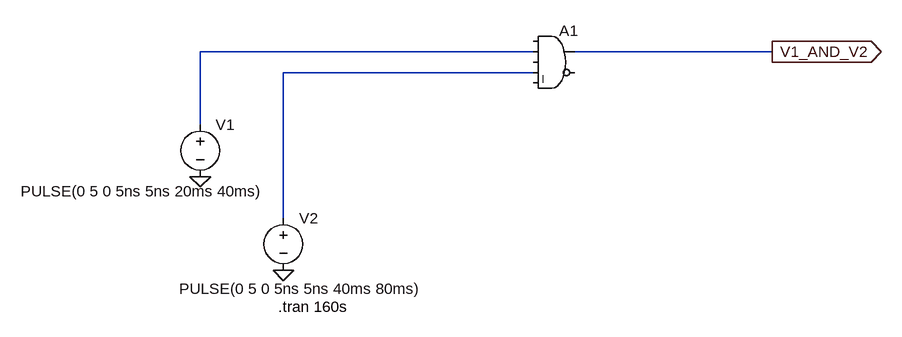
[diagram p0: schematic And gate.asc]
And gate.asc, the LTspice schematic file:
Version 4
SHEET 1 1144 680
WIRE 576 -48 64 -48
WIRE 944 -48 640 -48
WIRE 576 -16 192 -16
WIRE 64 64 64 -48
WIRE 192 208 192 -16
FLAG 64 144 0
FLAG 192 288 0
FLAG 944 -48 V1_AND_V2
IOPIN 944 -48 Out
SYMBOL voltage 64 48 R0
WINDOW 3 -276 119 Left 2
WINDOW 123 0 0 Left 0
WINDOW 39 0 0 Left 0
SYMATTR InstName V1
SYMATTR Value PULSE(0 5 0 5ns 5ns 20ms 40ms)
SYMBOL voltage 192 192 R0
WINDOW 3 -160 125 Left 2
WINDOW 123 0 0 Left 0
WINDOW 39 0 0 Left 0
SYMATTR InstName V2
SYMATTR Value PULSE(0 5 0 5ns 5ns 40ms 80ms)
SYMBOL Digital\\and 608 -96 R0
SYMATTR InstName A1
TEXT 184 344 Left 2 !.tran 160s

The netlist it stands for:
* And gate.asc
V1 N001 0 PULSE(0 5 0 5ns 5ns 20ms 40ms)
V2 N002 0 PULSE(0 5 0 5ns 5ns 40ms 80ms)
A1 0 N001 0 N002 0 0 V1_AND_V2 0 AND
.tran 160s
.backanno
.end